# Altium project SNES TST.PrjPcb
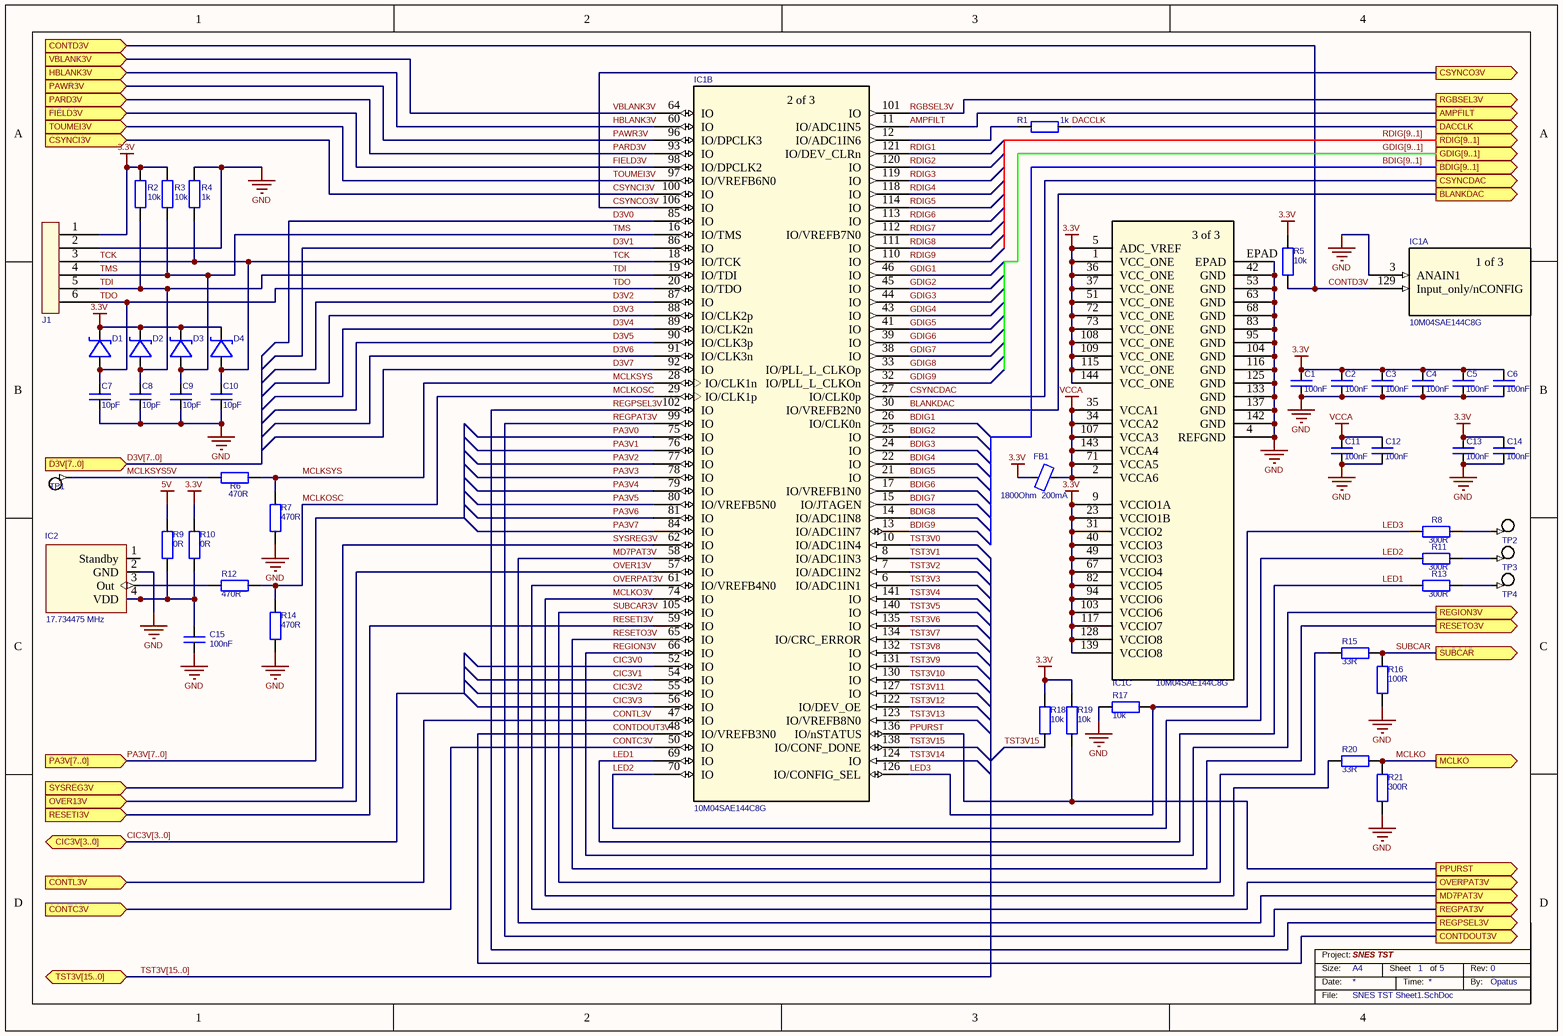
[diagram p0: SNES TST Sheet1.SchDoc]
Revision: Rev 0
2 sheets, 71 parts. Net scope: flat (ports and power ports of the same name join across sheets).
Board file: SNES TST.PcbDoc
Sheets:
  SNES TST Sheet1.SchDoc
  SNES TST Sheet5.SchDoc

## Sheet SNES TST Sheet1.SchDoc: SNES TST
size A4; DrawnBy: Opatus; DocumentNumber: 1; Revision: 0; SheetNumber: 1; SheetTotal: 5

### Parts
C1  100nF  [Cap_0402_Chip]
C2  100nF  [Cap_0402_Chip]
C3  100nF  [Cap_0402_Chip]
C4  100nF  [Cap_0402_Chip]
C5  100nF  [Cap_0402_Chip]
C6  100nF  [Cap_0402_Chip]
C7  10pF  [Cap_0402_Chip]
C8  10pF  [Cap_0402_Chip]
C9  10pF  [Cap_0402_Chip]
C10  10pF  [Cap_0402_Chip]
C11  100nF  [Cap_0402_Chip]
C12  100nF  [Cap_0402_Chip]
C13  100nF  [Cap_0402_Chip]
C14  100nF  [Cap_0402_Chip]
C15  100nF  [Cap_0402_Chip]
D1  Schottky Diode  [SOD323]  (value not drawn)
D2  Schottky Diode  [SOD323]  (value not drawn)
D3  Schottky Diode  [SOD323]  (value not drawn)
D4  Schottky Diode  [SOD323]  (value not drawn)
FB1  1800Ohm  200mA  [Ind_0402_Chip]
IC1  10M04SAE144C8G  [EQFP-144_A:1P65_]  (parts A,B,C of 3)
IC2  17.734475 MHz  [Quarz 7.5mm]
J1  Conn 6P  [Con6P]  (value not drawn)  (no BOM)
R1  1k  [Res_0402_Chip]
R2  10k  [Res_0402_Chip]
R3  10k  [Res_0402_Chip]
R4  1k  [Res_0402_Chip]
R5  10k  [Res_0402_Chip]
R6  470R  [Res_0603_Chip]
R7  470R  [Res_0603_Chip]
R8  300R  [Res_0603_Chip]
R9  0R  [Res_0402_Chip]
R10  0R  [Res_0402_Chip]
R11  300R  [Res_0603_Chip]
R12  470R  [Res_0603_Chip]
R13  300R  [Res_0603_Chip]
R14  470R  [Res_0603_Chip]
R15  33R  [Res_0603_Chip]
R16  100R  [Res_0603_Chip]
R17  10k  [Res_0402_Chip]
R18  10k  [Res_0402_Chip]
R19  10k  [Res_0402_Chip]
R20  33R  [Res_0603_Chip]
R21  300R  [Res_0603_Chip]
TP1  Pin Connector  [Pin Connector Small]  (value not drawn)  (no BOM)
TP2  Pin Connector  [Pin Connector Small]  (value not drawn)  (no BOM)
TP3  Pin Connector  [Pin Connector Small]  (value not drawn)  (no BOM)
TP4  Pin Connector  [Pin Connector Small]  (value not drawn)  (no BOM)

### Ports
AMPFILT (out), BDIG[9..1] (out), BLANKDAC (out), CIC3V[3..0] (bidir), CONTC3V (in), CONTD3V (in), CONTDOUT3V (out), CONTL3V (in), CSYNCDAC (out), CSYNCI3V (in), CSYNCO3V (out), D3V[7..0] (in), DACCLK (out), FIELD3V (in), GDIG[9..1] (out), HBLANK3V (in), MCLKO (out), MD7PAT3V (out), OVER13V (in), OVERPAT3V (out), PA3V[7..0] (in), PARD3V (in), PAWR3V (in), PPURST (out), RDIG[9..1] (out), REGION3V (out), REGPAT3V (out), REGPSEL3V (out), RESETI3V (in), RESETO3V (out), RGBSEL3V (out), SUBCAR (out), SYSREG3V (in), TOUMEI3V (in), TST3V[15..0] (bidir), VBLANK3V (in)

### Nets
3.3V: C1.1 C2.1 C3.1 C4.1 C5.1 C6.1 C13.1 C14.1 D1.1(K) D2.1(K) D3.1(K) D4.1(K) FB1.1 IC1.1(VCC_ONE) IC1.5(ADC_VREF) IC1.9(VCCIO1A) IC1.23(VCCIO1B) IC1.31(VCCIO2) IC1.36(VCC_ONE) IC1.37(VCC_ONE) IC1.40(VCCIO3) IC1.49(VCCIO3) IC1.51(VCC_ONE) IC1.67(VCCIO4) IC1.72(VCC_ONE) IC1.73(VCC_ONE) IC1.82(VCCIO5) IC1.94(VCCIO6) IC1.103(VCCIO6) IC1.108(VCC_ONE) IC1.109(VCC_ONE) IC1.115(VCC_ONE) IC1.117(VCCIO7) IC1.128(VCCIO8) IC1.139(VCCIO8) IC1.144(VCC_ONE) J1.1 R2.1 R3.1 R5.1 R10.1 R18.1 R19.1
5V: R9.1
GND: C1.2 C2.2 C3.2 C4.2 C5.2 C6.2 C7.2 C8.2 C9.2 C10.2 C11.2 C12.2 C13.2 C14.2 C15.2 IC1.3(ANAIN1) IC1.4(REFGND) IC1.42(GND) IC1.53(GND) IC1.63(GND) IC1.68(GND) IC1.83(GND) IC1.95(GND) IC1.104(GND) IC1.116(GND) IC1.125(GND) IC1.133(GND) IC1.137(GND) IC1.142(GND) IC1.EPAD IC2.2(GND) J1.2 R4.2 R7.2 R14.2 R16.2 R17.1 R21.2
VCCA: C11.1 C12.1 FB1.2 IC1.2(VCCA6) IC1.34(VCCA2) IC1.35(VCCA1) IC1.71(VCCA5) IC1.107(VCCA3) IC1.143(VCCA4)
AMPFILT: IC1.11(IO/ADC1IN5) ; port AMPFILT
BDIG1: IC1.26(IO/CLK0n)
BDIG2: IC1.25(IO)
BDIG3: IC1.24(IO)
BDIG4: IC1.22(IO)
BDIG5: IC1.21(IO)
BDIG6: IC1.17(IO/VREFB1N0)
BDIG7: IC1.15(IO/JTAGEN)
BDIG8: IC1.14(IO/ADC1IN8)
BDIG9: IC1.13(IO/ADC1IN7)
BLANKDAC: IC1.30(IO/VREFB2N0) ; port BLANKDAC
CIC3V0: IC1.52(IO)
CIC3V1: IC1.54(IO)
CIC3V2: IC1.55(IO)
CIC3V3: IC1.56(IO)
CONTC3V: IC1.50(IO) ; port CONTC3V
CONTD3V: IC1.129(Input_only/nCONFIG) R5.2 ; port CONTD3V
CONTDOUT3V: IC1.48(IO/VREFB3N0) ; port CONTDOUT3V
CONTL3V: IC1.47(IO) ; port CONTL3V
CSYNCDAC: IC1.27(IO/CLK0p) ; port CSYNCDAC
CSYNCI3V: IC1.100(IO) ; port CSYNCI3V
CSYNCO3V: IC1.106(IO) ; port CSYNCO3V
D3V0: IC1.85(IO)
D3V1: IC1.86(IO)
D3V2: IC1.87(IO)
D3V3: IC1.88(IO/CLK2p)
D3V4: IC1.89(IO/CLK2n)
D3V5: IC1.90(IO/CLK3p)
D3V6: IC1.91(IO/CLK3n)
D3V7: IC1.92(IO)
DACCLK: R1.2 ; port DACCLK
FIELD3V: IC1.98(IO/DPCLK2) ; port FIELD3V
GDIG1: IC1.46(IO)
GDIG2: IC1.45(IO)
GDIG3: IC1.44(IO)
GDIG4: IC1.43(IO)
GDIG5: IC1.41(IO)
GDIG6: IC1.39(IO)
GDIG7: IC1.38(IO)
GDIG8: IC1.33(IO/PLL_L_CLKOp)
GDIG9: IC1.32(IO/PLL_L_CLKOn)
HBLANK3V: IC1.60(IO) ; port HBLANK3V
LED1: IC1.69(IO) R13.2
LED2: IC1.70(IO) R11.2
LED3: IC1.126(IO/CONFIG_SEL) R8.2 R17.2
MCLKO: R20.1 R21.1 ; port MCLKO
MCLKO3V: IC1.74(IO) R20.2
MCLKOSC: IC1.29(IO/CLK1p) R12.1 R14.1
MCLKSYS: IC1.28(IO/CLK1n) R6.1 R7.1
MCLKSYS5V: R6.2 TP1.1
MD7PAT3V: IC1.58(IO) ; port MD7PAT3V
OVER13V: IC1.57(IO) ; port OVER13V
OVERPAT3V: IC1.61(IO/VREFB4N0) ; port OVERPAT3V
PA3V0: IC1.75(IO)
PA3V1: IC1.76(IO)
PA3V2: IC1.77(IO)
PA3V3: IC1.78(IO)
PA3V4: IC1.79(IO)
PA3V5: IC1.80(IO/VREFB5N0)
PA3V6: IC1.81(IO)
PA3V7: IC1.84(IO)
PARD3V: IC1.93(IO) ; port PARD3V
PAWR3V: IC1.96(IO/DPCLK3) ; port PAWR3V
PPURST: IC1.136(IO/nSTATUS) R19.2 ; port PPURST
RDIG1: IC1.121(IO/DEV_CLRn)
RDIG2: IC1.120(IO)
RDIG3: IC1.119(IO)
RDIG4: IC1.118(IO)
RDIG5: IC1.114(IO)
RDIG6: IC1.113(IO)
RDIG7: IC1.112(IO/VREFB7N0)
RDIG8: IC1.111(IO)
RDIG9: IC1.110(IO)
REGION3V: IC1.66(IO) ; port REGION3V
REGPAT3V: IC1.99(IO) ; port REGPAT3V
REGPSEL3V: IC1.102(IO) ; port REGPSEL3V
RESETI3V: IC1.59(IO) ; port RESETI3V
RESETO3V: IC1.65(IO) ; port RESETO3V
RGBSEL3V: IC1.101(IO) ; port RGBSEL3V
SUBCAR: R15.1 R16.1 ; port SUBCAR
SUBCAR3V: IC1.105(IO) R15.2
SYSREG3V: IC1.62(IO) ; port SYSREG3V
TCK: C10.1 D4.2(A) IC1.18(IO/TCK) J1.3 R4.1
TDI: C8.1 D2.2(A) IC1.19(IO/TDI) J1.5 R2.2
TDO: C7.1 D1.2(A) IC1.20(IO/TDO) J1.6
TMS: C9.1 D3.2(A) IC1.16(IO/TMS) J1.4 R3.2
TOUMEI3V: IC1.97(IO/VREFB6N0) ; port TOUMEI3V
TST3V0: IC1.10(IO/ADC1IN4)
TST3V1: IC1.8(IO/ADC1IN3)
TST3V2: IC1.7(IO/ADC1IN2)
TST3V3: IC1.6(IO/ADC1IN1)
TST3V4: IC1.141(IO)
TST3V5: IC1.140(IO)
TST3V6: IC1.135(IO)
TST3V7: IC1.134(IO/CRC_ERROR)
TST3V8: IC1.132(IO)
TST3V9: IC1.131(IO)
TST3V10: IC1.130(IO)
TST3V11: IC1.127(IO)
TST3V12: IC1.122(IO/DEV_OE)
TST3V13: IC1.123(IO/VREFB8N0)
TST3V14: IC1.124(IO)
TST3V15: IC1.138(IO/CONF_DONE) R18.2
VBLANK3V: IC1.64(IO) ; port VBLANK3V
NetC15_1: C15.1 IC2.4(VDD) R9.2 R10.2
NetIC1_12: IC1.12(IO/ADC1IN6) R1.1
NetIC2_3: IC2.3(Out) R12.2
NetR8_1: R8.1 TP2.1
NetR11_1: R11.1 TP3.1
NetR13_1: R13.1 TP4.1

Not connected (* = marked no-connect by the designer): IC2 1(Standby)

### Buses and harness runs
bus BDIG[9..1] = port BDIG[9..1]
bus CIC3V[3..0] = port CIC3V[3..0]
bus D3V[7..0] = port D3V[7..0]
bus GDIG[9..1] = port GDIG[9..1]
bus PA3V[7..0] = port PA3V[7..0]
bus RDIG[9..1] = port RDIG[9..1]
bus TST3V[15..0] = port TST3V[15..0]

### Notes on the sheet
- Size:
- Date:
- Project:
- A4
- Sheet
- Time:
- of
- Rev:
- By:
- File:
- (in symbol 10M08SAE144C8G, part A) 1 of 3
- (in symbol 10M08SAE144C8G, part B) 2 of 3
- (in symbol 10M08SAE144C8G, part C) 3 of 3

### Library data of the parts
C1-C15 = Capacitor: Nominal Voltage: 10V; Dielectric: X7R; Tolerance: +-20%
  C1-C6 C11-C15: Value: 100nF
  C7-C10: Value: 10pF
D1-D4 = Schottky Diode: Manufacturer_Part_Number: BAT54WS-7-F; Vendor: Diodes
FB1 = Ferrite Bead: Manufacturer_Part_Number: MMZ1005S182ET000; Vendor: TDK; Value: 1800Ohm  200mA
IC1 = 10M08SAE144C8G: No Description Available; SourceLibrary: Intel_2020-01-10; Built_By: EMA_Cory; Vendor: Intel; Copyright: Copyright (C) 2018 Accelerated Designs. All rights reserved; Manufacturer_Part_Number: 10M08SAE144C8G; RefDes: RefDes; Type: DEV
IC2 = Oscillator: Manufacturer_Part_Number: LFSPXO020648Bulk; Vendor: IQD Frequency; Frequency: 17.734475 MHz
J1 = Conn 6P: 6 Pole Connector
R1-R8 R11-R21 = R: Tolerance: +-1%
  R1 R4: Value: 1k
  R2 R3 R5 R17-R19: Value: 10k
  R6 R7 R12 R14: Value: 470R
  R8 R11 R13 R21: Value: 300R
  R15 R20: Value: 33R
  R16: Value: 100R
R9 R10 = R: Value: 0R

## Sheet SNES TST Sheet5.SchDoc: SNES TST
size A4; DrawnBy: Opatus; Revision: 0; SheetNumber: 5; SheetTotal: 5
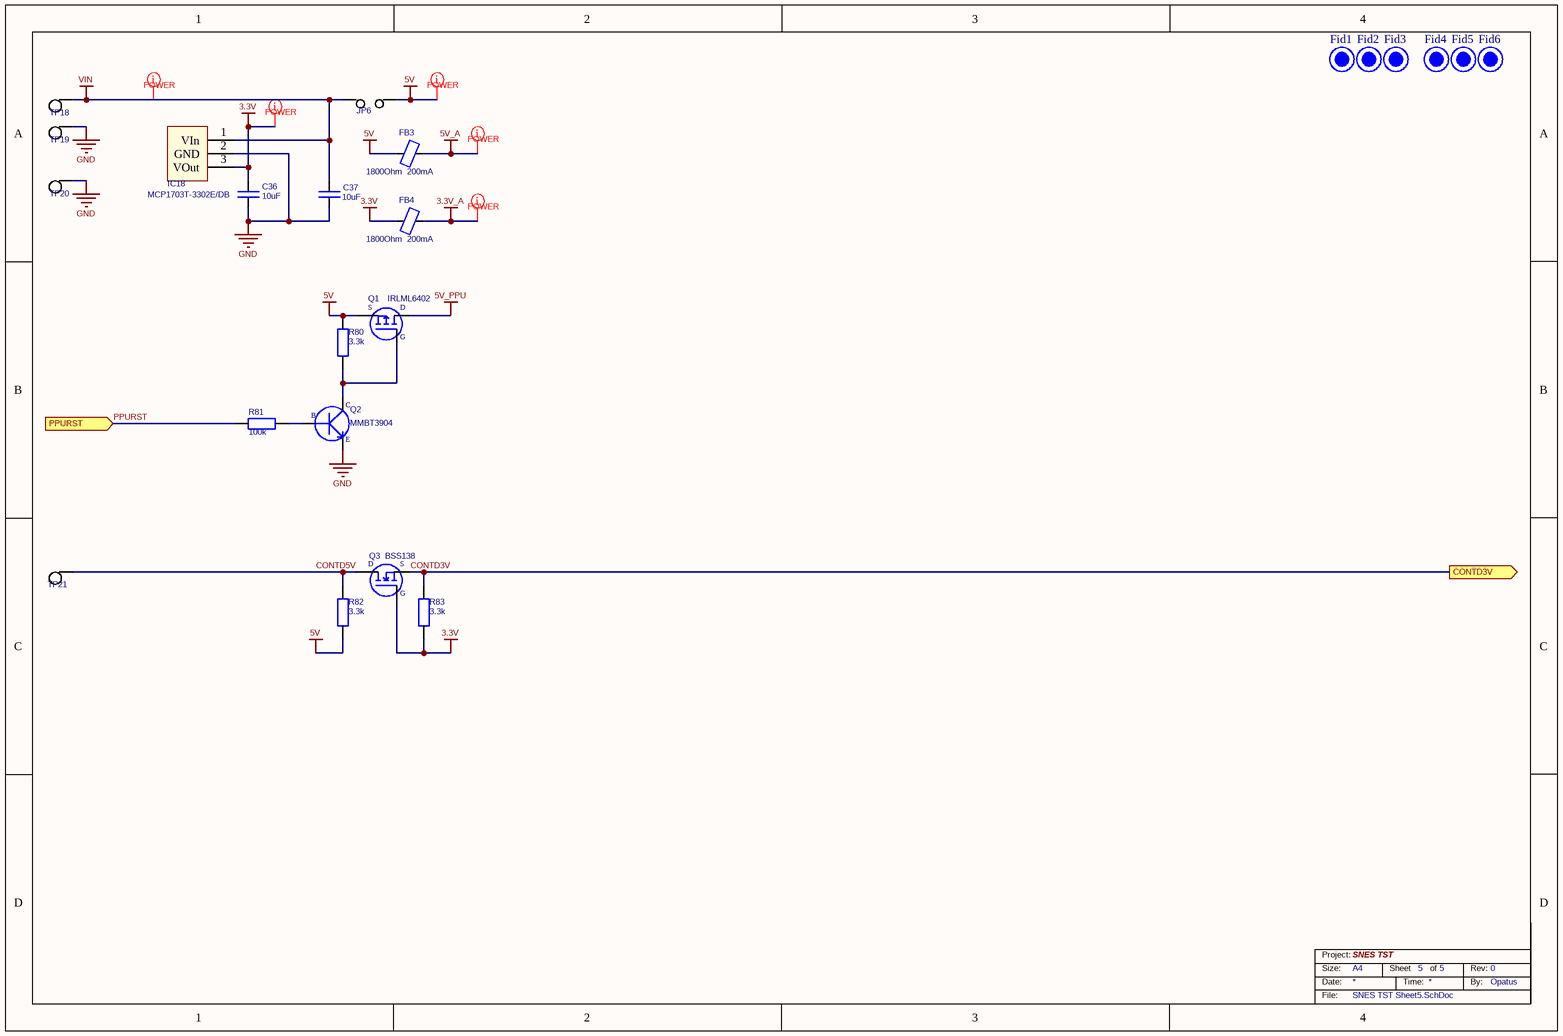
[diagram p1: SNES TST Sheet5.SchDoc]

### Parts
C36  10uF  [Cap_0805_Chip]
C37  10uF  [Cap_1206_Chip]
FB3  1800Ohm  200mA  [Ind_0402_Chip]
FB4  1800Ohm  200mA  [Ind_0402_Chip]
Fid1  Fiducial  [Fiducial_1_side]  (value not drawn)  (no BOM)
Fid2  Fiducial  [Fiducial_1_side]  (value not drawn)  (no BOM)
Fid3  Fiducial  [Fiducial_1_side]  (value not drawn)  (no BOM)
Fid4  Fiducial  [Fiducial_1_side]  (value not drawn)  (no BOM)
Fid5  Fiducial  [Fiducial_1_side]  (value not drawn)  (no BOM)
Fid6  Fiducial  [Fiducial_1_side]  (value not drawn)  (no BOM)
IC18  Manufacturer_Part_Number: MCP1703T-3302E/DB  [SOT223-3]  (hidden comment: MCP1703T)
JP6  Jumper  [Jumper Big]  (value not drawn)  (no BOM)
Q1  IRLML6402  [SOT23_FET]
Q2  MMBT3904  [SOT23_Transistor]
Q3  BSS138  [SOT23_FET]
R80  3.3k  [Res_0402_Chip]
R81  100k  [Res_0402_Chip]
R82  3.3k  [Res_0402_Chip]
R83  3.3k  [Res_0402_Chip]
TP18  Pin Connector  [Pin Connector Small]  (value not drawn)  (no BOM)
TP19  Pin Connector  [Pin Connector Small]  (value not drawn)  (no BOM)
TP20  Pin Connector  [Pin Connector Small]  (value not drawn)  (no BOM)
TP21  Pin Connector  [Pin Connector Small]  (value not drawn)  (no BOM)

### Ports
CONTD3V (out), PPURST (in)

### Nets
3.3V: C36.2 FB4.1 IC18.3(VOut) Q3.G R83.2
3.3V_A: FB4.2
5V: FB3.1 JP6.1 Q1.S R80.1 R82.2
5V_A: FB3.2
5V_PPU: Q1.D
GND: C36.1 C37.1 IC18.2(GND) Q2.E TP19.1 TP20.1
VIN: C37.2 IC18.1(VIn) JP6.2 TP18.1
CONTD3V: Q3.S R83.1 ; port CONTD3V
CONTD5V: Q3.D R82.1 TP21.1
PPURST: R81.1 ; port PPURST
NetQ1_G: Q1.G Q2.C R80.2
NetQ2_B: Q2.B R81.2

### Layout directives
net class POWER: 3.3V, 3.3V_A, 5V, 5V_A, VIN

### Notes on the sheet
- Size:
- Date:
- Project:
- A4
- Sheet
- Time:
- of
- Rev:
- By:
- File:

### Library data of the parts
C36 = Capacitor: as C1 on sheet SNES TST Sheet1; Value: 10uF
C37 = Capacitor: Nominal Voltage: 25V; Dielectric: X7R; Tolerance: +-20%; Value: 10uF
FB3 FB4 = Ferrite Bead: as FB1 on sheet SNES TST Sheet1; Value: 1800Ohm  200mA
IC18 = MCP1703 SOT223: 3.3V Regulator; Vendor: Microchip
Q1 = Mosfet1: Vendor: Diodes; Manufacturer_Part_Number: IRLML6402
Q2 = T_NPN: Vendor: Diodes; Manufacturer_Part_Number: MMBT3904
Q3 = Mosfet N: Vendor: Infenion; Manufacturer_Part_Number: BSS138
R80-R83 = R: Tolerance: +-1%
  R80 R82 R83: Value: 3.3k
  R81: Value: 100k

## Nets that join several sheets
3.3V: SNES TST Sheet1 (43 pins), SNES TST Sheet5 (5 pins)
5V: SNES TST Sheet1 (R9.1), SNES TST Sheet5 (5 pins)
GND: SNES TST Sheet1 (38 pins), SNES TST Sheet5 (6 pins)
CONTD3V: SNES TST Sheet1 (IC1.129 R5.2), SNES TST Sheet5 (Q3.S R83.1)
PPURST: SNES TST Sheet1 (IC1.136 R19.2), SNES TST Sheet5 (R81.1)

## Assembly variants
NTSC System: not fitted R10
PAL System: not fitted R9